# EAGLE design TRICORDER (EAGLE 8.2.0)
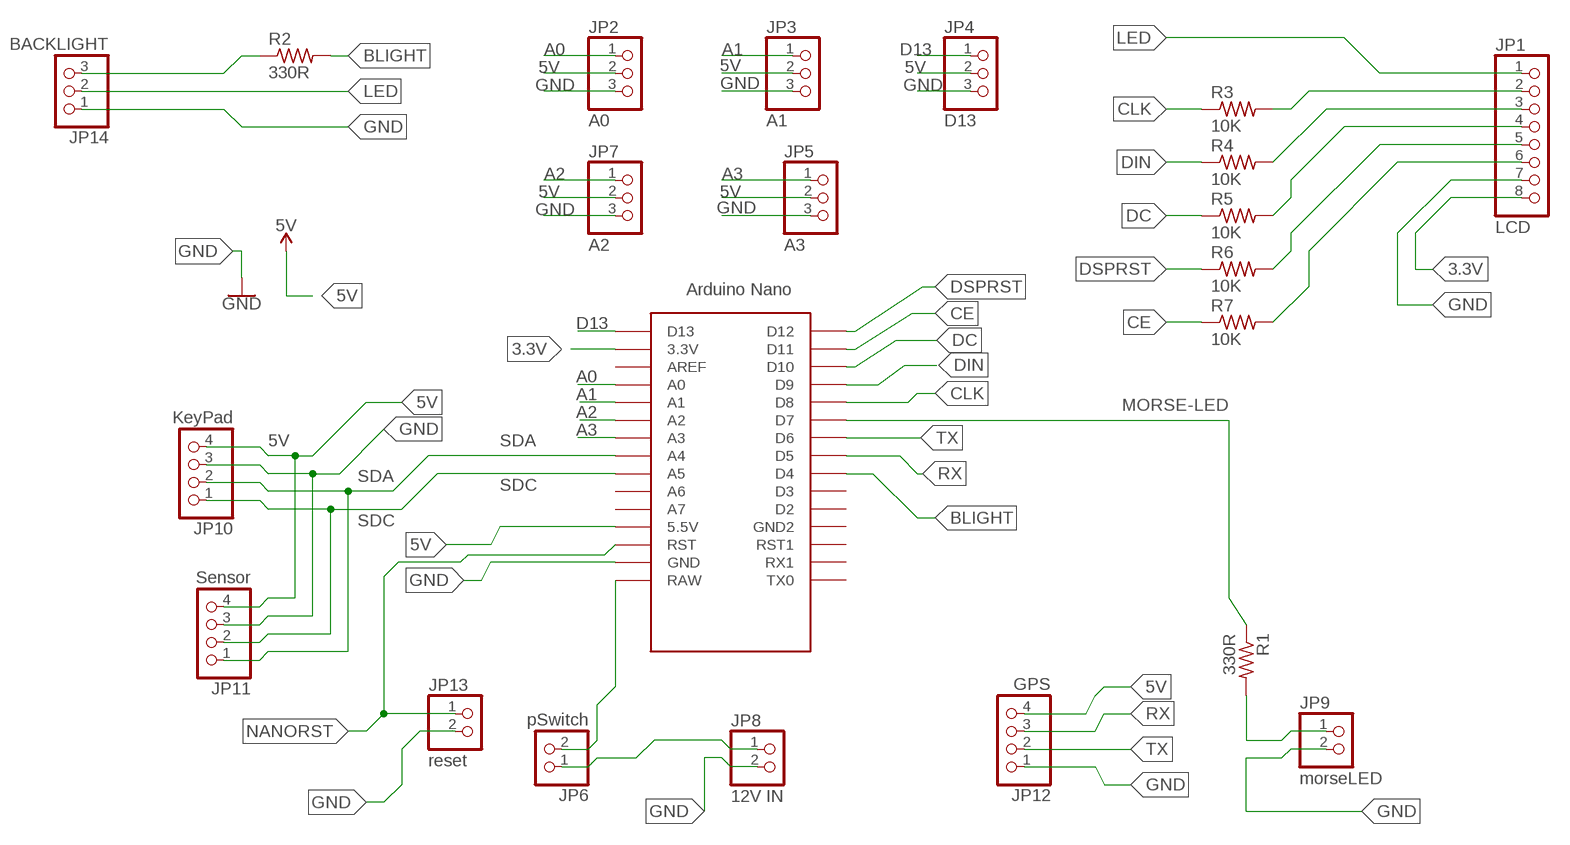
[diagram p0: schematic, sheet 1]

## Parts
JP1  LCD  PINHD-1X8/90  [1X08/90]
JP2  A0  PINHD-1X3  [1X03]
JP3  A1  PINHD-1X3  [1X03]
JP4  D13  PINHD-1X3  [1X03]
JP5  A3  PINHD-1X3  [1X03]
JP6  pSwitch  PINHD-1X2/90  [1X02/90]
JP7  A2  PINHD-1X3  [1X03]
JP8  12V IN  PINHD-1X2/90  [1X02/90]
JP9  morseLED  PINHD-1X2/90  [1X02/90]
JP10  KeyPad  PINHD-1X4/90  [1X04/90]
JP11  Sensor  PINHD-1X4/90  [1X04/90]
JP12  GPS  PINHD-1X4/90  [1X04/90]
JP13  reset  PINHD-1X2/90  [1X02/90]
JP14  BACKLIGHT  PINHD-1X3/90  [1X03/90]
R1  330R  R-US_0207/9  [0207/9]
R2  330R  R-US_0207/9  [0207/9]
R3  10K  R-US_0207/9  [0207/9]
R4  10K  R-US_0207/9  [0207/9]
R5  10K  R-US_0207/9  [0207/9]
R6  10K  R-US_0207/9  [0207/9]
R7  10K  R-US_0207/9  [0207/9]
U$1  NANO  [NANO]

## Nets
3.3V: JP1.8 U$1.3.3V
5V: JP2.2 JP3.2 JP4.2 JP5.2 JP7.2 JP10.4 JP11.4 JP12.4 U$1.5V(5.5V)
12V: JP6.1 JP8.1
12VS: JP6.2 U$1.RAW
A0: JP2.1 U$1.A0
A1: JP3.1 U$1.A1
A2: JP7.1 U$1.A2
A3: JP5.1 U$1.A3
BLIGHT: R2.2 U$1.D4
CE: R7.1 U$1.D11
CLK: R3.1 U$1.D8
D13: JP4.1 U$1.D13
DC: R5.1 U$1.D10
DIN: R4.1 U$1.D9
DSPRST: R6.1 U$1.D12
GND: JP1.7 JP2.3 JP3.3 JP4.3 JP5.3 JP7.3 JP8.2 JP9.2 JP10.3 JP11.3 JP12.1 JP13.2 JP14.1 U$1.GND
LED: JP1.1 JP14.2
MORSE-LED: R1.1 U$1.D7
N$1: JP9.1 R1.2
N$2: JP14.3 R2.1
N$3: JP1.2 R3.2
N$4: JP1.3 R4.2
N$5: JP1.4 R5.2
N$6: JP1.5 R6.2
N$7: JP1.6 R7.2
NANORST: JP13.1 U$1.RST
RX: JP12.3 U$1.D5
SDA: JP10.2 JP11.1 U$1.A4
SDC: JP10.1 JP11.2 U$1.A5
TX: JP12.2 U$1.D6
Unconnected: U$1.A6 U$1.A7 U$1.AREF U$1.D2 U$1.D3 U$1.GND1(GND2) U$1.ICSP1 U$1.ICSP2 U$1.ICSP3 U$1.ICSP4 U$1.ICSP5 U$1.ICSP6 U$1.RST1 U$1.RX1 U$1.TX0

## Library data of the parts
JP1 = pinhead:PINHD-1X8: PIN HEADER
JP2-JP5 JP7 JP14 = pinhead:PINHD-1X3: PIN HEADER
JP6 JP8 JP9 JP13 = pinhead:PINHD-1X2: PIN HEADER
JP10-JP12 = pinhead:PINHD-1X4: PIN HEADER
R1-R7 = adafruit:R-US_: RESISTOR, American symbol
U$1 = Arduino-clone:NANO: Arduino Nano

## Board
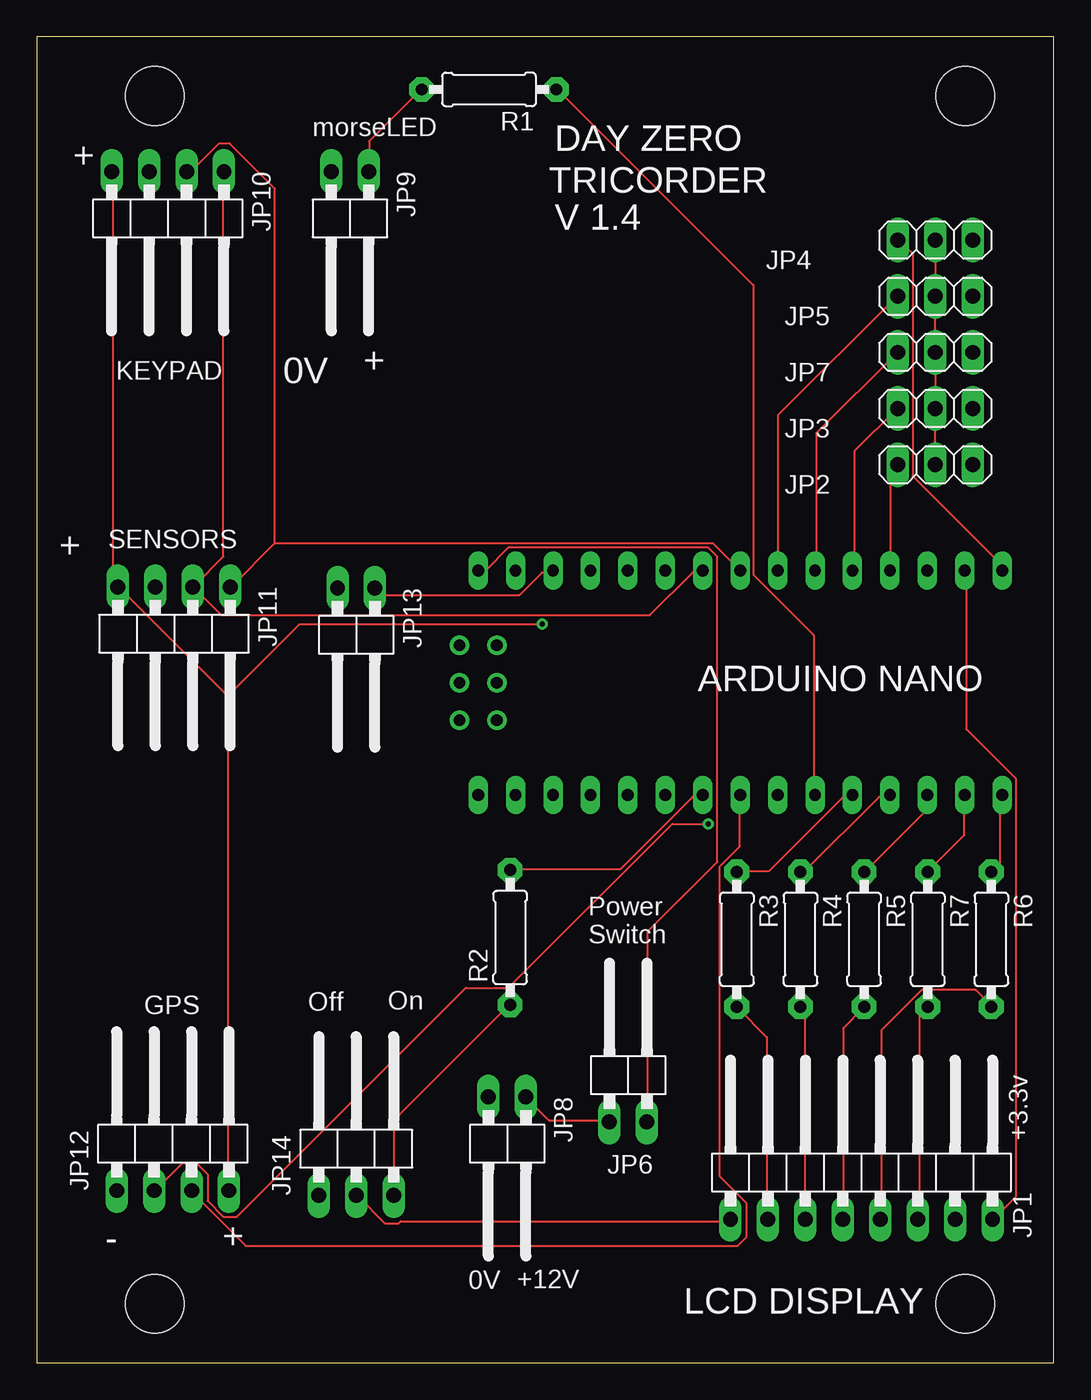
[diagram p1: board, top side]
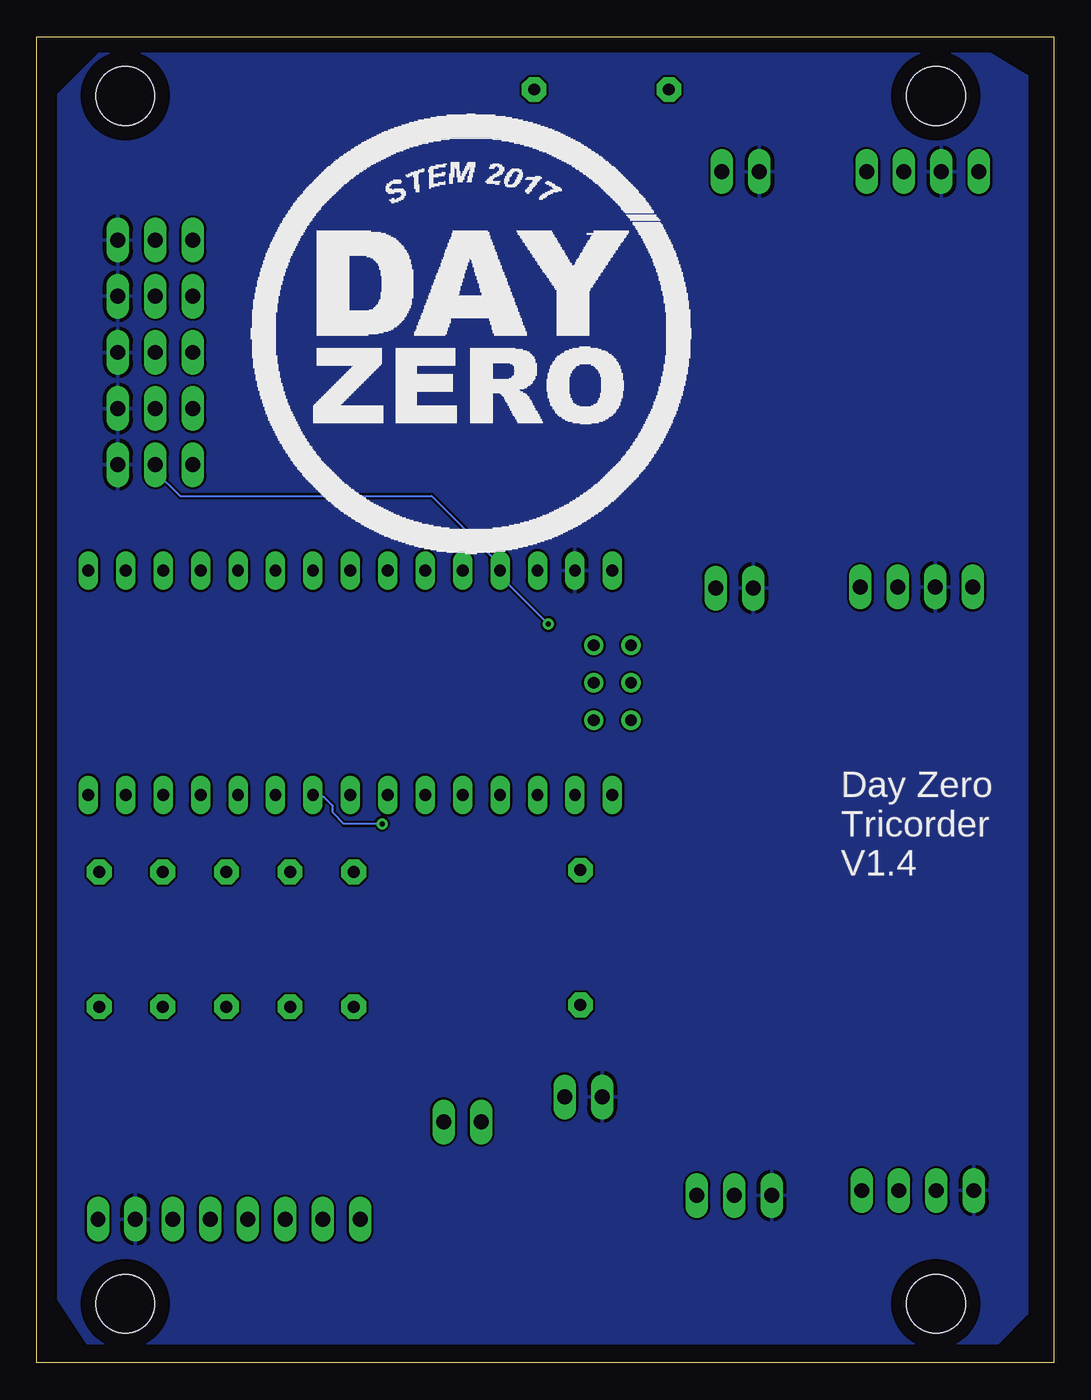
[diagram p2: board, bottom side, seen from below]

Size 69 x 90 mm. Coordinates in mm from the lower left corner, seen from the top.
Outline: 0,0 69,0 69,90 0,90 0,0
Copper layers (1*16): Top 0.035mm / dielectric 1.5mm / Bottom 0.035mm
Design rules "default": minimum track width 6mil, minimum drill 0.35mm, track to track 6mil, track to pad 6mil, pad to pad 6mil, via to via 6mil, smd to smd 6mil, copper to edge 40mil, drill to drill 6mil, minimum pad ring 10mil, minimum via ring 8mil, stop-mask expansion 4mil, vias tented up to drill 0mil, thermal gap 10mil
Holes 4 mm at 63,86 8,86 8,4 63,4

### Footprints (pad centres in the part's own frame; a part is rotated, then mirrored left to right if it is on the bottom)
1X08/90 = drill 1.016 long: 1 -8.89,-3.81; 2 -6.35,-3.81; 3 -3.81,-3.81; 4 -1.27,-3.81; 5 1.27,-3.81; 6 3.81,-3.81; 7 6.35,-3.81; 8 8.89,-3.81
1X03 = drill 1.016 long: 1 -2.54,0; 2 0,0; 3 2.54,0
1X02/90 = drill 1.016 long: 1 -1.27,-3.81; 2 1.27,-3.81
1X04/90 = drill 1.016 long: 1 -3.81,-3.81; 2 -1.27,-3.81; 3 1.27,-3.81; 4 3.81,-3.81
1X03/90 = drill 1.016 long: 1 -2.54,-3.81; 2 0,-3.81; 3 2.54,-3.81
0207/9 = drill 0.813 pad 1.676 octagon: 1 -4.572,0; 2 4.572,0
NANO = drill 0.8 long: 3.3V -10.16,24.13; 5V -10.16,-1.27; A0 -10.16,19.05; A1 -10.16,16.51; A2 -10.16,13.97; A3 -10.16,11.43; A4 -10.16,8.89; A5 -10.16,6.35; A6 -10.16,3.81; A7 -10.16,1.27; AREF -10.16,21.59; D2 5.08,1.27; D3 5.08,3.81; D4 5.08,6.35; D5 5.08,8.89; D6 5.08,11.43; D7 5.08,13.97; D8 5.08,16.51; D9 5.08,19.05; D10 5.08,21.59; D11 5.08,24.13; D12 5.08,26.67; D13 -10.16,26.67; GND -10.16,-6.35; GND1 5.08,-1.27; RAW -10.16,-8.89; RST -10.16,-3.81; RST1 5.08,-3.81; RX1 5.08,-6.35; TX0 5.08,-8.89 | drill 0.8: ICSP1 -5.08,-10.16; ICSP2 -5.08,-7.62; ICSP3 -2.54,-10.16; ICSP4 -2.54,-7.62; ICSP5 0,-10.16; ICSP6 0,-7.62

### Placement (x,y rotation side)
JP1  55.96,13.55 0 top
JP2  60.96,60.96 0 top
JP3  60.96,64.77 0 top
JP4  60.96,76.2 0 top
JP5  60.96,72.39 0 top
JP6  40.13,20.15 0 top
JP7  60.96,68.58 0 top
JP8  31.92,14.22 180 top
JP9  21.25,77.04 180 top
JP10  8.89,77.04 180 top
JP11  9.31,48.85 180 top
JP12  9.23,15.49 0 top
JP13  21.67,48.76 180 top
JP14  21.67,15.15 0 top
R1  30.68,86.43 180 top
R2  32.12,28.86 90 top
R3  47.5,28.74 270 top
R4  51.82,28.74 270 top
R5  56.13,28.74 270 top
R6  64.77,28.74 270 top
R7  60.45,28.74 270 top
U$1  38.84,43.61 270 top

### Tracks (layer width: path | path; a pad name or v marks a point on that pad's centre or on a via)
3.3V
  Top 0.152: U$1.3.3V 63.09,53.65 63.09,42.98 66.45,39.62 66.45,11.28 64.92,9.75 JP1.8
5V  (via drill 0.35)
  Top 0.152: JP4.2 JP5.2 JP7.2 JP3.2 JP2.2 | 12.95,45.26 12.95,11.73 JP12.4 | 12.95,45.26 5.64,52.58 JP11.4 5.49,52.73 5.18,53.03 5.18,80.77 JP10.4 | v34.29,50.14 17.83,50.14 12.95,45.26
  Bottom 0.152: JP2.2 60.96,60.5 59.28,58.83 42.22,58.83 37.64,54.25 37.64,53.8 U$1.5V 37.49,53.65 37.49,53.34 v34.29,50.14
12V
  Top 0.152: JP6.1 38.71,16.46 34.75,16.46 33.22,17.98 JP8.1
12VS
  Top 0.152: U$1.RAW 30.02,53.8 30.48,53.8 32,55.32 45.57,55.32 46.18,54.71 46.18,33.98 41.45,29.26 41.45,16.46 JP6.2
A0
  Top 0.152: U$1.A0 57.91,53.8 57.91,60.5 58.37,60.96 JP2.1
A1
  Top 0.152: U$1.A1 55.47,53.8 55.47,61.87 58.37,64.77 JP3.1
A2
  Top 0.152: U$1.A2 52.88,53.8 52.88,63.09 58.37,68.58 JP7.1
A3
  Top 0.152: U$1.A3 50.29,53.8 50.29,64.31 58.37,72.39 JP5.1
BLIGHT
  Top 0.152: U$1.D4 45.11,38.41 44.5,38.41 39.62,33.53 32.16,33.53 R2.2
CE
  Top 0.152: U$1.D11 62.94,38.41 62.94,35.81 60.5,33.38 R7.1
CLK
  Top 0.152: U$1.D8 55.32,38.41 54.71,38.41 49.68,33.38 47.55,33.38 R3.1
D13
  Top 0.152: U$1.D13 65.38,53.8 65.38,54.25 59.44,60.2 59.44,75.29 58.52,76.2 JP4.1
DC
  Top 0.152: U$1.D10 60.35,38.41 60.35,37.49 56.24,33.38 R5.1
DIN
  Top 0.152: U$1.D9 57.76,38.41 57.15,38.41 52.12,33.38 51.82,33.38 R4.1
DSPRST
  Top 0.152: U$1.D12 65.38,38.41 65.38,33.98 64.77,33.38 R6.1
GND
  pour Bottom: 1.78,87.38 1.78,3.3 3.81,1.27 65.53,1.27 67.56,4.32 67.56,86.11 64.77,88.9 4.32,88.9
LED
  Top 0.152: JP1.1 46.94,9.6 24.69,9.6 24.54,9.45 23.62,9.45 21.79,11.28 JP14.2
MORSE-LED
  Top 0.152: U$1.D7 52.73,38.56 52.73,49.38 48.62,53.49 48.62,73.15 35.36,86.41 R1.1
N$1
  Top 0.152: JP9.1 22.55,80.92 22.55,82.91 26.06,86.41 R1.2
N$2
  Top 0.152: JP14.3 24.23,11.43 24.23,16.46 32,24.23 R2.1
N$3
  Top 0.152: JP1.2 49.53,9.75 49.53,22.1 47.55,24.08 R3.2
N$4
  Top 0.152: JP1.3 52.12,9.75 52.12,23.77 51.82,24.08 R4.2
N$5
  Top 0.152: JP1.4 54.71,9.75 54.71,22.71 56.08,24.08 R5.2
N$6
  Top 0.152: JP1.5 57.3,9.75 57.3,22.55 60.05,25.3 63.7,25.3 64.77,24.23 R6.2
N$7
  Top 0.152: JP1.6 59.89,9.75 59.89,23.62 60.35,24.08 R7.2
NANORST
  Top 0.152: U$1.RST 34.9,53.65 34.29,53.65 32.77,52.12 23.32,52.12 23.01,52.43 JP13.1
RX
  Top 0.152: U$1.D5 47.7,38.41 47.7,35.05 46.33,33.68 46.33,12.65 48.16,10.82 48.16,8.53 47.55,7.92 14.17,7.92 10.52,11.58 JP12.3
SDA
  Top 0.152: U$1.A4 45.87,55.63 16.15,55.63 | 16.15,55.63 13.26,52.73 JP11.1 | 16.15,55.63 16.15,79.7 13.11,82.75 12.34,82.75 10.52,80.92 10.21,80.92 JP10.2
SDC
  Top 0.152: U$1.A5 45.11,53.65 44.5,53.65 41.6,50.75 12.5,50.75 10.67,52.58 JP11.2 10.67,52.73 12.65,54.71 12.65,80.77 JP10.1
TX  (via drill 0.35)
  Top 0.152: v45.57,36.58 43.13,36.58 32,25.45 29.11,25.45 13.56,9.91 12.65,9.91 11.58,10.97 11.58,12.8 10.82,13.56 9.91,13.56 8.08,11.73 JP12.2
  Bottom 0.152: v45.57,36.58 48.16,36.58 48.92,37.34 48.92,37.8 49.53,38.41 50.14,38.41 U$1.D6

### Text on the board
tPlace: morseLED | DAY ZERO | + | TRICORDER | V 1.4 | 0V | KEYPAD | + | + | SENSORS | ARDUINO NANO | Power / Switch | GPS | Off | On | +3.3v | - | + | +12V | 0V | LCD DISPLAY
bPlace: Day Zero / Tricorder / V1.4